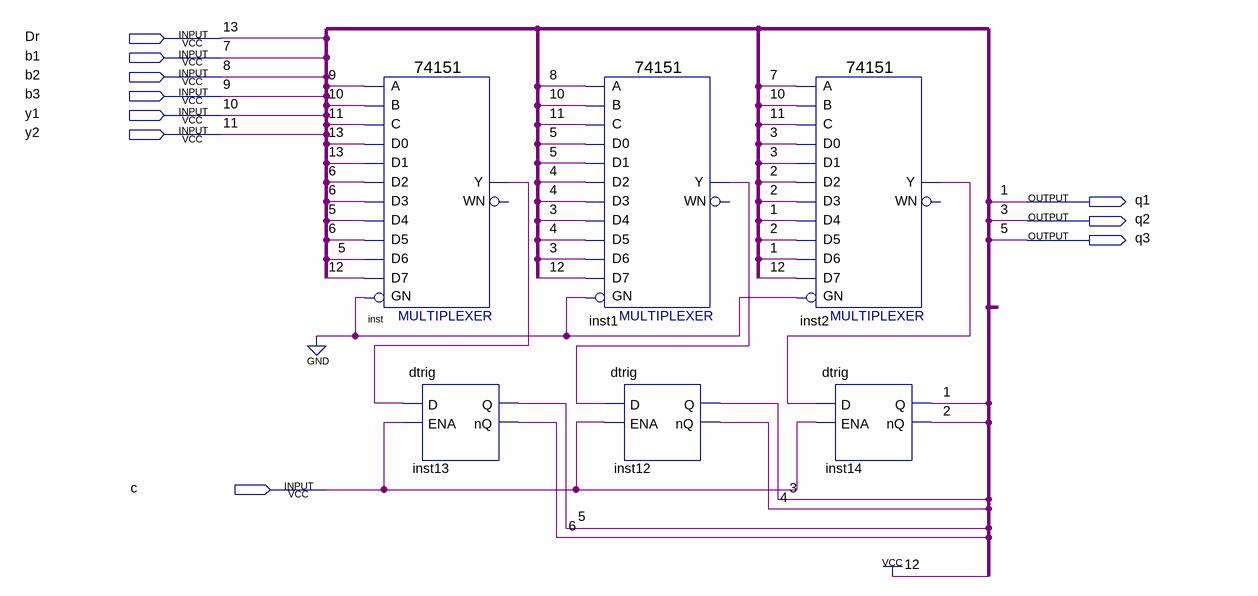
[diagram p0: schematic sheet]
// Quartus schematic Shema.bdf as structural Verilog: 6 symbols, 10 pins
module Shema (
  input  Dr,
  input  b1,
  input  b2,
  input  b3,
  input  y1,
  input  y2,
  input  c,
  output q1,
  output q2,
  output q3
);

  wire \2 , \4 , \6 , inst1_y, inst2_y, inst_y;

  \74151  inst (
    .GN(1'b0), .C(y2), .B(y1), .A(b3), .D5(\6 ), .D0(Dr), .D1(Dr), .D4(q3), .D3(\6 ), .D2(\6 ), .D6(q3),
    .D7(1'b1), .Y(inst_y));  // open: WN
  dtrig inst13 (.D(inst_y), .ENA(c), .Q(q3), .nQ(\6 ));
  \74151  inst1 (
    .GN(1'b0), .C(y2), .B(y1), .A(b2), .D5(\4 ), .D0(q3), .D1(q3), .D4(q2), .D3(\4 ), .D2(\4 ), .D6(q2),
    .D7(1'b1), .Y(inst1_y));  // open: WN
  dtrig inst12 (.D(inst1_y), .ENA(c), .Q(q2), .nQ(\4 ));
  \74151  inst2 (
    .GN(1'b0), .C(y2), .B(y1), .A(b1), .D5(\2 ), .D0(q2), .D1(q2), .D4(q1), .D3(\2 ), .D2(\2 ), .D6(q1),
    .D7(1'b1), .Y(inst2_y));  // open: WN
  dtrig inst14 (.D(inst2_y), .ENA(c), .Q(q1), .nQ(\2 ));

  // Other names for the same wires on the sheet: 1 = q1; 3 = q2; 5 = q3; 7 = b1; 8 = b2; 9 = b3; 10 = y1; 11 = y2;
  //   13 = Dr
endmodule
